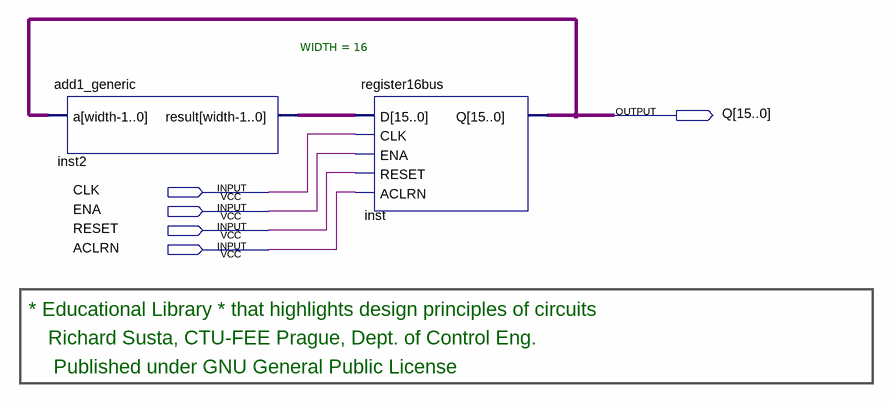
[diagram p0: schematic sheet]
// Quartus schematic counter16bus.bdf as structural Verilog: 2 symbols, 5 pins
module counter16bus (
  input  CLK,
  input  ENA,
  input  RESET,
  input  ACLRN,
  output [15:0] Q
);

  wire [15:0] inst2_result;

  add1_generic #(.WIDTH(16)) inst2 (.a(Q), .result(inst2_result));
  register16bus inst (.D(inst2_result), .CLK(CLK), .ENA(ENA), .RESET(RESET), .ACLRN(ACLRN), .Q(Q));

  // Notes on the sheet:
  //   * Educational Library * that highlights design principles of circuits
  //   Richard Susta, CTU-FEE Prague, Dept. of Control Eng. 
  //    Published under GNU General Public License
endmodule
